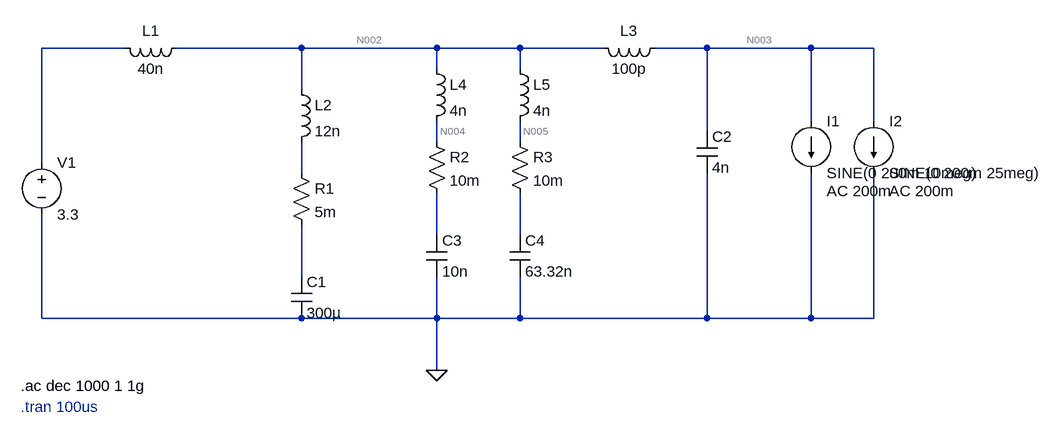
[diagram p0: schematic Design.asc]
Design.asc, the LTspice schematic file:
Version 4.1
SHEET 1 1272 680
WIRE -160 0 -288 0
WIRE 112 0 -80 0
WIRE 320 0 112 0
WIRE 448 0 320 0
WIRE 576 0 448 0
WIRE 736 0 656 0
WIRE 896 0 736 0
WIRE 992 0 896 0
WIRE 320 32 320 0
WIRE 448 32 448 0
WIRE 112 64 112 0
WIRE 896 112 896 0
WIRE 992 112 992 0
WIRE 736 128 736 0
WIRE 320 144 320 112
WIRE 448 144 448 112
WIRE -288 176 -288 0
WIRE 112 192 112 144
WIRE 320 288 320 224
WIRE 448 288 448 224
WIRE 112 352 112 272
WIRE -288 416 -288 256
WIRE 112 416 -288 416
WIRE 320 416 320 352
WIRE 320 416 112 416
WIRE 448 416 448 352
WIRE 448 416 320 416
WIRE 736 416 736 192
WIRE 736 416 448 416
WIRE 896 416 896 192
WIRE 896 416 736 416
WIRE 992 416 992 192
WIRE 992 416 896 416
WIRE 320 496 320 416
FLAG 320 496 0
SYMBOL res 96 176 R0
SYMATTR InstName R1
SYMATTR Value 5m
SYMBOL ind -64 -16 R90
WINDOW 0 5 56 VBottom 2
WINDOW 3 32 56 VTop 2
SYMATTR InstName L1
SYMATTR Value 40n
SYMBOL ind 96 48 R0
SYMATTR InstName L2
SYMATTR Value 12n
SYMBOL ind 672 -16 R90
WINDOW 0 5 56 VBottom 2
WINDOW 3 32 56 VTop 2
SYMATTR InstName L3
SYMATTR Value 100p
SYMBOL cap 96 352 R0
SYMATTR InstName C1
SYMATTR Value 300µ
SYMBOL cap 720 128 R0
SYMATTR InstName C2
SYMATTR Value 4n
SYMBOL voltage -288 160 R0
WINDOW 123 0 0 Left 0
WINDOW 39 0 0 Left 0
SYMATTR InstName V1
SYMATTR Value 3.3
SYMBOL current 896 112 R0
WINDOW 123 24 108 Left 2
WINDOW 39 0 0 Left 0
SYMATTR Value2 AC 200m
SYMATTR InstName I1
SYMATTR Value SINE(0 200m 10meg)
SYMBOL current 992 112 R0
WINDOW 123 24 108 Left 2
WINDOW 39 0 0 Left 0
SYMATTR Value2 AC 200m
SYMATTR InstName I2
SYMATTR Value SINE(0 200m 25meg)
SYMBOL res 304 128 R0
SYMATTR InstName R2
SYMATTR Value 10m
SYMBOL res 432 128 R0
SYMATTR InstName R3
SYMATTR Value 10m
SYMBOL ind 304 16 R0
SYMATTR InstName L4
SYMATTR Value 4n
SYMBOL ind 432 16 R0
SYMATTR InstName L5
SYMATTR Value 4n
SYMBOL cap 304 288 R0
SYMATTR InstName C3
SYMATTR Value 10n
SYMBOL cap 432 288 R0
SYMATTR InstName C4
SYMATTR Value 63.32n
TEXT -320 520 Left 2 !.ac dec 1000 1 1g
TEXT -320 552 Left 2 ;.tran 100us

The netlist it stands for:
* Design.asc
R1 N006 N009 5m
L1 N002 N001 40n
L2 N002 N006 12n
L3 N003 N002 100p
C1 N009 0 300µ
C2 N003 0 4n
V1 N001 0 3.3
I1 N003 0 SINE(0 200m 10meg) AC 200m
I2 N003 0 SINE(0 200m 25meg) AC 200m
R2 N004 N007 10m
R3 N005 N008 10m
L4 N002 N004 4n
L5 N002 N005 4n
C3 N007 0 10n
C4 N008 0 63.32n
.ac dec 1000 1 1g
* .tran 100us
.backanno
.end

* Results of the author's LTspice run, read from the files saved beside the schematic
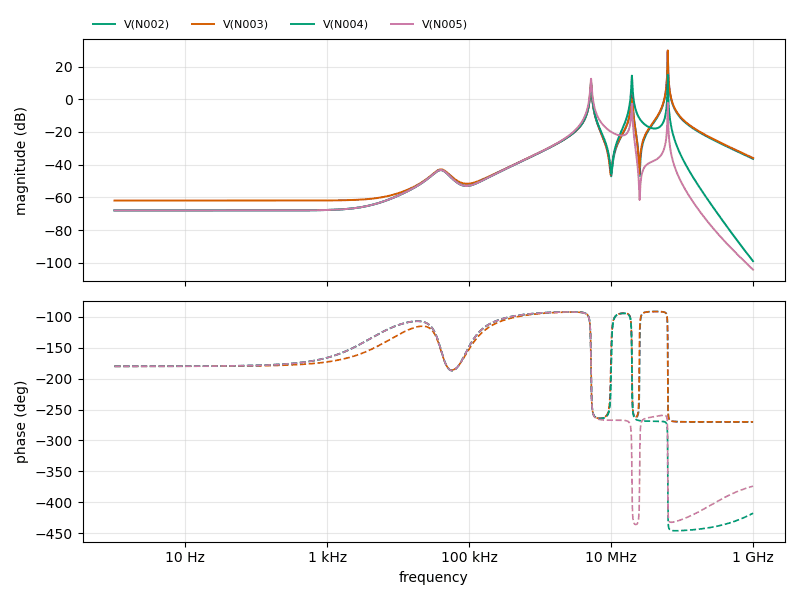
[diagram p1: AC Analysis of Design.asc, plotted from the saved traces]
* AC Analysis, 1 run:
*   V(N002): -67.96 dB at 1 Hz, -36.45 dB at 1 GHz, peak 29.29 dB at 62.81 MHz, 3 dB below the peak at 62.5 MHz and 62.99 MHz
*   V(N003): -61.94 dB at 1 Hz, -35.93 dB at 1 GHz, peak 29.85 dB at 62.81 MHz, 3 dB below the peak at 62.5 MHz and 62.99 MHz
*   V(N004): -67.96 dB at 1 Hz, -98.96 dB at 1 GHz, peak 14.93 dB at 62.81 MHz, 3 dB below the peak at 62.49 MHz and 62.98 MHz
*   V(N005): -67.96 dB at 1 Hz, -104.18 dB at 1 GHz, peak 12.52 dB at 5.2 MHz, 3 dB below the peak at 5.129 MHz and 5.283 MHz